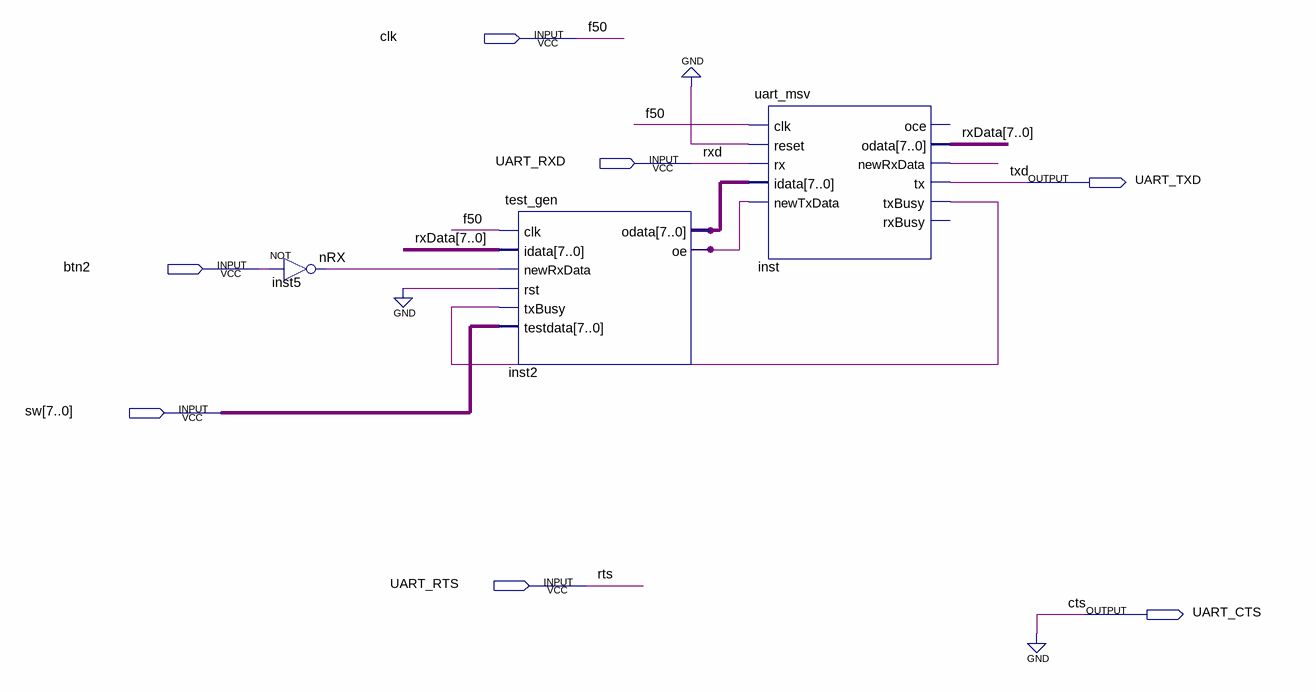
[diagram p0: schematic sheet]
// Quartus schematic test_rs232.bdf as structural Verilog: 3 symbols, 7 pins
module test_rs232 (
  input  clk,
  input  UART_RXD,
  input  btn2,
  input  [7:0] sw,
  input  UART_RTS,
  output UART_TXD,
  output UART_CTS
);

  wire inst2_oe, inst_newrxdata, inst_txbusy, nRX;
  wire [7:0] inst2_odata, rxData;

  not inst5 (nRX, btn2);
  test_gen inst2 (
    .clk(clk), .idata(rxData), .newRxData(nRX), .rst(1'b0), .txBusy(inst_txbusy), .testdata(sw),
    .odata(inst2_odata), .oe(inst2_oe));
  uart_msv inst (
    .clk(clk), .reset(1'b0), .rx(UART_RXD), .idata(inst2_odata), .newTxData(inst2_oe), .odata(rxData),
    .newRxData(inst_newrxdata), .tx(UART_TXD), .txBusy(inst_txbusy));  // open: oce, rxBusy

  assign UART_CTS = 1'b0;

  // Other names for the same wires on the sheet: f50 = clk; rts = UART_RTS; rxd = UART_RXD; txd = UART_TXD
endmodule
